# EAGLE schematic Schematic (EAGLE 9.7.0)
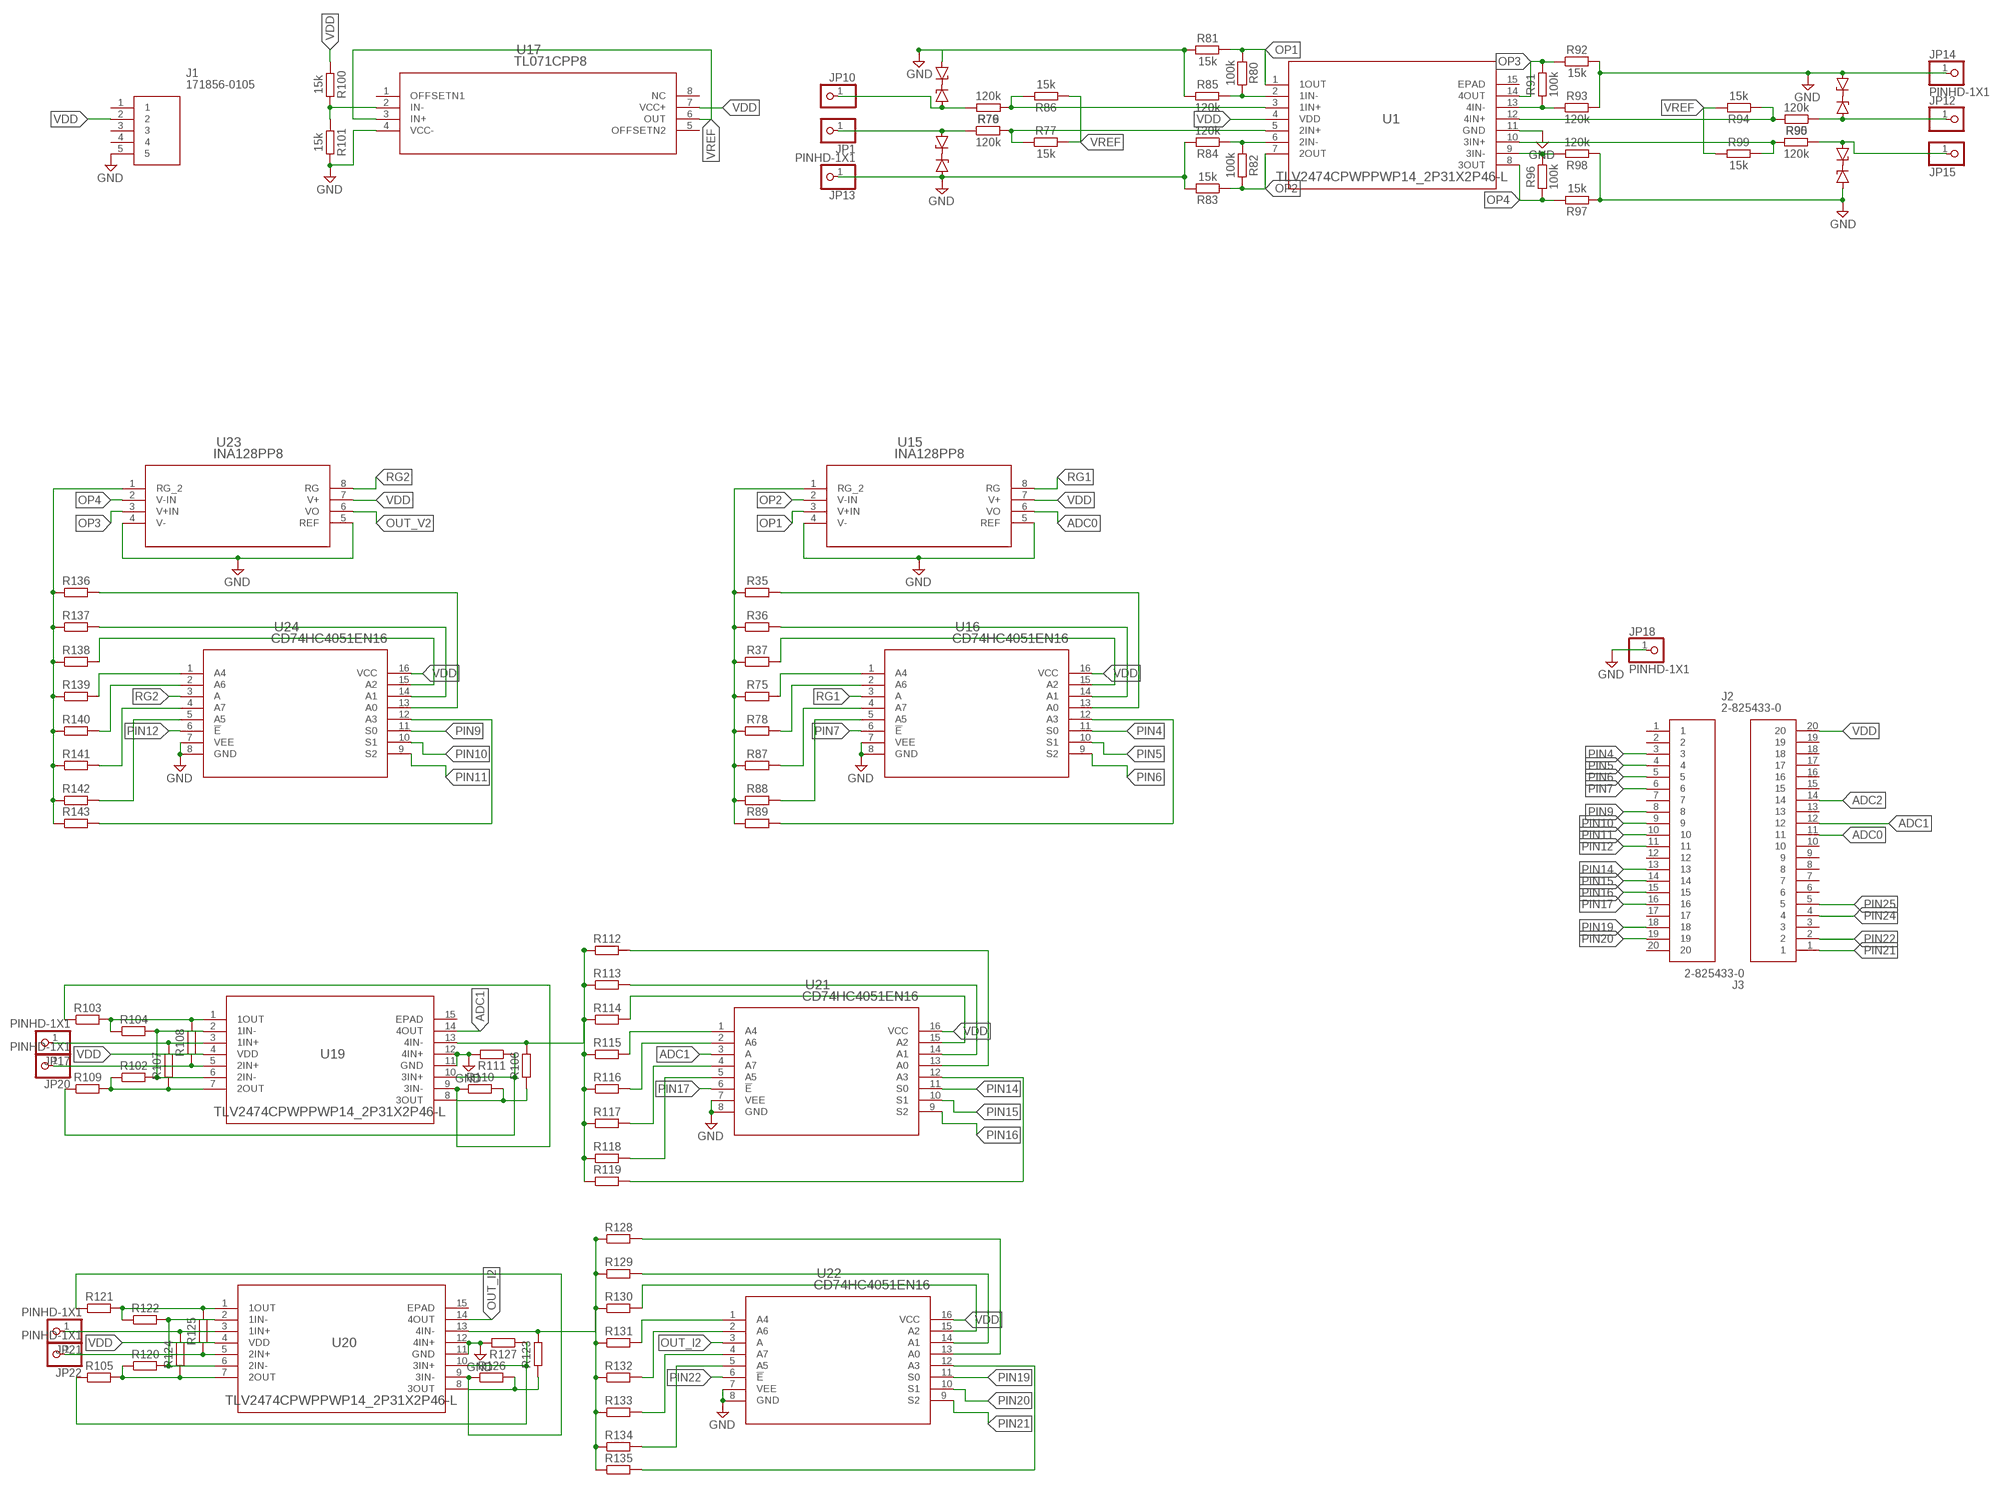
[diagram p0: schematic, sheet 1]

## Parts
D1  1SMB5920B  ZENER_1SMB5920BDO-214AA(SMB)  [DIOM5336X265N]
D2  1SMB5920B  ZENER_1SMB5920BDO-214AA(SMB)  [DIOM5336X265N]
D9  1SMB5920B  ZENER_1SMB5920BDO-214AA(SMB)  [DIOM5336X265N]
D10  1SMB5920B  ZENER_1SMB5920BDO-214AA(SMB)  [DIOM5336X265N]
D11  1SMB5920B  ZENER_1SMB5920BDO-214AA(SMB)  [DIOM5336X265N]
D12  1SMB5920B  ZENER_1SMB5920BDO-214AA(SMB)  [DIOM5336X265N]
D13  1SMB5920B  ZENER_1SMB5920BDO-214AA(SMB)  [DIOM5336X265N]
D14  1SMB5920B  ZENER_1SMB5920BDO-214AA(SMB)  [DIOM5336X265N]
J1  171856-0105  [HDRV5W99P0X254_1X5_1255X635X10]
J2  2-825433-0  [HDRV20W63P0X254_1X20_5080X369X]
J3  2-825433-0  [HDRV20W63P0X254_1X20_5080X369X]
JP1  PINHD-1X1  [1X01]
JP10  PINHD-1X1  [1X01]
JP12  PINHD-1X1  [1X01]
JP13  PINHD-1X1  [1X01]
JP14  PINHD-1X1  [1X01]
JP15  PINHD-1X1  [1X01]
JP17  PINHD-1X1  [1X01]
JP18  PINHD-1X1  [1X01]
JP20  PINHD-1X1  [1X01]
JP21  PINHD-1X1  [1X01]
JP22  PINHD-1X1  [1X01]
R35  R_AXIAL-7.2MM-PITCH  [RESAD724W46L381D178B]
R36  R_AXIAL-7.2MM-PITCH  [RESAD724W46L381D178B]
R37  R_AXIAL-7.2MM-PITCH  [RESAD724W46L381D178B]
R75  R_AXIAL-7.2MM-PITCH  [RESAD724W46L381D178B]
R76  120k  R_AXIAL-7.2MM-PITCH  [RESAD724W46L381D178B]
R77  15k  R_AXIAL-7.2MM-PITCH  [RESAD724W46L381D178B]
R78  R_AXIAL-7.2MM-PITCH  [RESAD724W46L381D178B]
R79  120k  R_AXIAL-7.2MM-PITCH  [RESAD724W46L381D178B]
R80  100k  R_AXIAL-7.2MM-PITCH  [RESAD724W46L381D178B]
R81  15k  R_AXIAL-7.2MM-PITCH  [RESAD724W46L381D178B]
R82  100k  R_AXIAL-7.2MM-PITCH  [RESAD724W46L381D178B]
R83  15k  R_AXIAL-7.2MM-PITCH  [RESAD724W46L381D178B]
R84  120k  R_AXIAL-7.2MM-PITCH  [RESAD724W46L381D178B]
R85  120k  R_AXIAL-7.2MM-PITCH  [RESAD724W46L381D178B]
R86  15k  R_AXIAL-7.2MM-PITCH  [RESAD724W46L381D178B]
R87  R_AXIAL-7.2MM-PITCH  [RESAD724W46L381D178B]
R88  R_AXIAL-7.2MM-PITCH  [RESAD724W46L381D178B]
R89  R_AXIAL-7.2MM-PITCH  [RESAD724W46L381D178B]
R90  120k  R_AXIAL-7.2MM-PITCH  [RESAD724W46L381D178B]
R91  100k  R_AXIAL-7.2MM-PITCH  [RESAD724W46L381D178B]
R92  15k  R_AXIAL-7.2MM-PITCH  [RESAD724W46L381D178B]
R93  120k  R_AXIAL-7.2MM-PITCH  [RESAD724W46L381D178B]
R94  15k  R_AXIAL-7.2MM-PITCH  [RESAD724W46L381D178B]
R95  120k  R_AXIAL-7.2MM-PITCH  [RESAD724W46L381D178B]
R96  100k  R_AXIAL-7.2MM-PITCH  [RESAD724W46L381D178B]
R97  15k  R_AXIAL-7.2MM-PITCH  [RESAD724W46L381D178B]
R98  120k  R_AXIAL-7.2MM-PITCH  [RESAD724W46L381D178B]
R99  15k  R_AXIAL-7.2MM-PITCH  [RESAD724W46L381D178B]
R100  15k  R_AXIAL-7.2MM-PITCH  [RESAD724W46L381D178B]
R101  15k  R_AXIAL-7.2MM-PITCH  [RESAD724W46L381D178B]
R102  R_AXIAL-7.2MM-PITCH  [RESAD724W46L381D178B]
R103  R_AXIAL-7.2MM-PITCH  [RESAD724W46L381D178B]
R104  R_AXIAL-7.2MM-PITCH  [RESAD724W46L381D178B]
R105  R_AXIAL-7.2MM-PITCH  [RESAD724W46L381D178B]
R106  R_AXIAL-7.2MM-PITCH  [RESAD724W46L381D178B]
R107  R_AXIAL-7.2MM-PITCH  [RESAD724W46L381D178B]
R108  R_AXIAL-7.2MM-PITCH  [RESAD724W46L381D178B]
R109  R_AXIAL-7.2MM-PITCH  [RESAD724W46L381D178B]
R110  R_AXIAL-7.2MM-PITCH  [RESAD724W46L381D178B]
R111  R_AXIAL-7.2MM-PITCH  [RESAD724W46L381D178B]
R112  R_AXIAL-7.2MM-PITCH  [RESAD724W46L381D178B]
R113  R_AXIAL-7.2MM-PITCH  [RESAD724W46L381D178B]
R114  R_AXIAL-7.2MM-PITCH  [RESAD724W46L381D178B]
R115  R_AXIAL-7.2MM-PITCH  [RESAD724W46L381D178B]
R116  R_AXIAL-7.2MM-PITCH  [RESAD724W46L381D178B]
R117  R_AXIAL-7.2MM-PITCH  [RESAD724W46L381D178B]
R118  R_AXIAL-7.2MM-PITCH  [RESAD724W46L381D178B]
R119  R_AXIAL-7.2MM-PITCH  [RESAD724W46L381D178B]
R120  R_AXIAL-7.2MM-PITCH  [RESAD724W46L381D178B]
R121  R_AXIAL-7.2MM-PITCH  [RESAD724W46L381D178B]
R122  R_AXIAL-7.2MM-PITCH  [RESAD724W46L381D178B]
R123  R_AXIAL-7.2MM-PITCH  [RESAD724W46L381D178B]
R124  R_AXIAL-7.2MM-PITCH  [RESAD724W46L381D178B]
R125  R_AXIAL-7.2MM-PITCH  [RESAD724W46L381D178B]
R126  R_AXIAL-7.2MM-PITCH  [RESAD724W46L381D178B]
R127  R_AXIAL-7.2MM-PITCH  [RESAD724W46L381D178B]
R128  R_AXIAL-7.2MM-PITCH  [RESAD724W46L381D178B]
R129  R_AXIAL-7.2MM-PITCH  [RESAD724W46L381D178B]
R130  R_AXIAL-7.2MM-PITCH  [RESAD724W46L381D178B]
R131  R_AXIAL-7.2MM-PITCH  [RESAD724W46L381D178B]
R132  R_AXIAL-7.2MM-PITCH  [RESAD724W46L381D178B]
R133  R_AXIAL-7.2MM-PITCH  [RESAD724W46L381D178B]
R134  R_AXIAL-7.2MM-PITCH  [RESAD724W46L381D178B]
R135  R_AXIAL-7.2MM-PITCH  [RESAD724W46L381D178B]
R136  R_AXIAL-7.2MM-PITCH  [RESAD724W46L381D178B]
R137  R_AXIAL-7.2MM-PITCH  [RESAD724W46L381D178B]
R138  R_AXIAL-7.2MM-PITCH  [RESAD724W46L381D178B]
R139  R_AXIAL-7.2MM-PITCH  [RESAD724W46L381D178B]
R140  R_AXIAL-7.2MM-PITCH  [RESAD724W46L381D178B]
R141  R_AXIAL-7.2MM-PITCH  [RESAD724W46L381D178B]
R142  R_AXIAL-7.2MM-PITCH  [RESAD724W46L381D178B]
R143  R_AXIAL-7.2MM-PITCH  [RESAD724W46L381D178B]
U1  TLV2474CPWPPWP14_2P31X2P46-L  [PWP14_2P31X2P46-L]
U15  INA128PP8  [P8]
U16  CD74HC4051EN16  [N16]
U17  TL071CPP8  [P8]
U19  TLV2474CPWPPWP14_2P31X2P46-L  [PWP14_2P31X2P46-L]
U20  TLV2474CPWPPWP14_2P31X2P46-L  [PWP14_2P31X2P46-L]
U21  CD74HC4051EN16  [N16]
U22  CD74HC4051EN16  [N16]
U23  INA128PP8  [P8]
U24  CD74HC4051EN16  [N16]

## Nets
ADC0: J3.11 U15.6(VO)
ADC1: J3.12 U19.14(4OUT) U21.3(A)
ADC2: J3.14
GND: D2.2(A) D10.2(A) D12.2(A) D14.2(A) J1.5 JP13.1 JP14.1 JP18.1 R81.2 R83.2 R84.2 R85.2 R92.2 R93.2 R97.2 R98.2 R101.2 R111.2 R127.2 U1.11(GND) U15.4(V-) U15.5(REF) U16.7(VEE) U16.8(GND) U17.4(VCC-) U19.11(GND) U19.12(4IN+) U20.11(GND) U20.12(4IN+) U21.7(VEE) U21.8(GND) U22.7(VEE) U22.8(GND) U23.4(V-) U23.5(REF) U24.7(VEE) U24.8(GND)
N$4: D1.1(C) D2.1(C)
N$6: R35.2 U16.13(A0)
N$8: R90.2 R94.1 U1.12(4IN+)
N$27: R36.2 U16.14(A1)
N$60: D11.1(C) D12.1(C)
N$116: D9.1(C) D10.1(C)
N$117: R76.2 R77.1 U1.5(2IN+)
N$118: R79.2 R86.1 U1.3(1IN+)
N$119: R91.1 R93.1 U1.13(4IN-)
N$120: D13.1(C) D14.1(C)
N$121: R82.1 R84.1 U1.6(2IN-)
N$122: R95.2 R99.1 U1.10(3IN+)
N$123: R80.1 R85.1 U1.2(1IN-)
N$124: R37.2 U16.15(A2)
N$125: R75.2 U16.1(A4)
N$126: R78.2 U16.2(A6)
N$127: R87.2 U16.4(A7)
N$128: R88.2 U16.5(A5)
N$129: R89.2 U16.12(A3)
N$130: R35.1 R36.1 R37.1 R75.1 R78.1 R87.1 R88.1 R89.1 U15.1(RG_2)
N$131: R96.1 R98.1 U1.9(3IN-)
N$132: R100.2 R101.1 U17.2(IN-)
N$134: JP20.1 R108.1 U19.5(2IN+)
N$151: JP17.1 R107.2 U19.3(1IN+)
N$152: R106.1 R110.2 U19.8(3OUT)
N$153: R106.2 R112.1 R113.1 R114.1 R115.1 R116.1 R117.1 R118.1 R119.1 U19.13(4IN-)
N$154: R113.2 U21.14(A1)
N$155: R109.1 R111.1 U19.10(3IN+)
N$156: R103.2 R104.1 R108.2 U19.1(1OUT)
N$157: R102.2 R104.2 U19.2(1IN-) U19.6(2IN-)
N$159: R114.2 U21.15(A2)
N$160: R102.1 R107.1 R109.2 U19.7(2OUT)
N$161: R103.1 R110.1 U19.9(3IN-)
N$162: R115.2 U21.1(A4)
N$163: R116.2 U21.2(A6)
N$164: R117.2 U21.4(A7)
N$165: R118.2 U21.5(A5)
N$166: R119.2 U21.12(A3)
N$167: R123.1 R126.2 U20.8(3OUT)
N$168: R112.2 U21.13(A0)
N$169: R123.2 R128.1 R129.1 R130.1 R131.1 R132.1 R133.1 R134.1 R135.1 U20.13(4IN-)
N$170: JP22.1 R125.1 U20.5(2IN+)
N$171: JP21.1 R124.2 U20.3(1IN+)
N$172: R105.1 R127.1 U20.10(3IN+)
N$173: R121.2 R122.1 R125.2 U20.1(1OUT)
N$174: R120.2 R122.2 U20.2(1IN-) U20.6(2IN-)
N$176: R105.2 R120.1 R124.1 U20.7(2OUT)
N$177: R121.1 R126.1 U20.9(3IN-)
N$178: R129.2 U22.14(A1)
N$179: R130.2 U22.15(A2)
N$180: R131.2 U22.1(A4)
N$181: R132.2 U22.2(A6)
N$182: R133.2 U22.4(A7)
N$183: R134.2 U22.5(A5)
N$184: R135.2 U22.12(A3)
N$185: R128.2 U22.13(A0)
N$186: R137.2 U24.14(A1)
N$187: R138.2 U24.15(A2)
N$188: R139.2 U24.1(A4)
N$189: R140.2 U24.2(A6)
N$190: R141.2 U24.4(A7)
N$191: R142.2 U24.5(A5)
N$192: R143.2 U24.12(A3)
N$193: R136.1 R137.1 R138.1 R139.1 R140.1 R141.1 R142.1 R143.1 U23.1(RG_2)
N$194: R136.2 U24.13(A0)
OP1: R80.2 R81.1 U1.1(1OUT) U15.3(V+IN)
OP2: R82.2 R83.1 U1.7(2OUT) U15.2(V-IN)
OP3: R91.2 R92.1 U1.14(4OUT) U23.3(V+IN)
OP4: R96.2 R97.1 U1.8(3OUT) U23.2(V-IN)
OUT_I2: U20.14(4OUT) U22.3(A)
OUT_V2: U23.6(VO)
PIN4: J2.3 U16.11(S0)
PIN5: J2.4 U16.10(S1)
PIN6: J2.5 U16.9(S2)
PIN7: J2.6 U16.6(!E)
PIN9: J2.8 U24.11(S0)
PIN10: J2.9 U24.10(S1)
PIN11: J2.10 U24.9(S2)
PIN12: J2.11 U24.6(!E)
PIN14: J2.13 U21.11(S0)
PIN15: J2.14 U21.10(S1)
PIN16: J2.15 U21.9(S2)
PIN17: J2.16 U21.6(!E)
PIN19: J2.18 U22.11(S0)
PIN20: J2.19 U22.10(S1)
PIN21: J3.1 U22.9(S2)
PIN22: J3.2 U22.6(!E)
PIN24: J3.4
PIN25: J3.5
RG1: U15.8(RG) U16.3(A)
RG2: U23.8(RG) U24.3(A)
V+1: D9.2(A) JP1.1 R76.1
V+2: D1.2(A) JP12.1 R90.1
V+3: D11.2(A) JP10.1 R79.1
V+4: D13.2(A) JP15.1 R95.1
VDD: J1.2 J3.20 R100.1 U1.4(VDD) U15.7(V+) U16.16(VCC) U17.7(VCC+) U19.4(VDD) U20.4(VDD) U21.16(VCC) U22.16(VCC) U23.7(V+) U24.16(VCC)
VREF: R77.2 R86.2 R94.2 R99.2 U17.3(IN+) U17.6(OUT)
Unconnected: J1.1 J1.3 J1.4 J2.1 J2.2 J2.7 J2.12 J2.17 J2.20 J3.3 J3.6 J3.7 J3.8 J3.9 J3.10 J3.13 J3.15 J3.16 J3.17 J3.18 J3.19 U1.15(EPAD) U17.1(OFFSETN1) U17.5(OFFSETN2) U17.8(NC) U19.15(EPAD) U20.15(EPAD)

## Library data of the parts
D1 D2 D9-D14 = Diode:ZENER_: Zener Diode - Popular parts; CATEGORY: Diode; DESCRIPTION: DIODE ZENER 6.2V 3W SMB; MANUFACTURER: Diodes Incorporated; MPN: 1SMB5920B-13; SUB-CATEGORY: Zener; THERMALLOSS: 3W
J1 = pin5:171856-0105: KK RPC .100 HEADER ASSEMBLY FRICTION LOCK SOLID BODY. Source: Datasheet <https://componentsearchengine.com/Datasheets/1/171856-0105.pdf>; DESCRIPTION: KK RPC .100 HEADER ASSEMBLY FRICTION LOCK SOLID BODY.; HEIGHT: 10.66mm; MANUFACTURER_NAME: Molex; MANUFACTURER_PART_NUMBER: 171856-0105; MOUSER_PART_NUMBER: 538-171856-0105; MOUSER_PRICE-STOCK: https://www.mouser.co.uk/ProductDetail/Molex/171856-0105?qs=EU6FO9ffTwd%2F6iYgCbhDyg%3D%3D
J2 J3 = pin20:2-825433-0: Headers & Wire Housings 20P HEADER 6.70mm 2.54mm CENTERLINE Source: Datasheet <https://www.te.com/commerce/DocumentDelivery/DDEController?Action=showdoc&DocId=Customer Drawing825433SpdfEnglishENG_CD_825433_S_baseFilename.pdf2-825433-0>; DESCRIPTION: Headers & Wire Housings 20P HEADER 6.70mm 2.54mm CENTERLINE; HEIGHT: 9.7mm; MANUFACTURER_NAME: TE Connectivity; MANUFACTURER_PART_NUMBER: 2-825433-0; MOUSER_PART_NUMBER: 571-2-825433-0; MOUSER_PRICE-STOCK: https://www.mouser.co.uk/ProductDetail/TE-Connectivity/2-825433-0?qs=Yxch5oR%2FTsPyWO6AE6CpEQ%3D%3D
JP1 JP10 JP12-JP15 JP17 JP18 JP20-JP22 = Connector:PINHD-1X1: PIN HEADER; CATEGORY: CONNECTOR; SUB-CATEGORY: PIN-HEADER
R35-R37 R75-R143 = Resistor:R: Resistor Fixed - Generic; CATEGORY: Resistor; SUB-CATEGORY: Fixed
U1 U19 U20 = TLV2474CPWP:TLV2474CPWP; COPYRIGHT: Copyright (C) 2023 Ultra Librarian. All rights reserved.; MANUFACTURER_PART_NUMBER: TLV2474CPWP; MFR_NAME: Texas Instruments
U15 U23 = INA128P:INA128P; COPYRIGHT: Copyright (C) 2023 Ultra Librarian. All rights reserved.; MANUFACTURER_PART_NUMBER: INA128P; MFR_NAME: Texas Instruments
U16 U21 U22 U24 = analogmux8_1:CD74HC4051E; COPYRIGHT: Copyright (C) 2023 Ultra Librarian. All rights reserved.; MANUFACTURER_PART_NUMBER: CD74HC4051E; MFR_NAME: Texas Instruments
U17 = tl071:TL071CP; COPYRIGHT: Copyright (C) 2023 Ultra Librarian. All rights reserved.; MANUFACTURER_PART_NUMBER: TL071CP; MFR_NAME: Texas Instruments

## Module PC
Ports: 

### Library data of the parts

## Module INA326
Ports: R1(nc) VIN-(nc) VIN+(nc) VREF(nc) R1'(nc) VIN+'(nc) VOUT(nc) R2(nc)

### Library data of the parts